# Altium schematic sheet ExpansionConnector.SchDoc: StepMotor Controller
size A4; Organization: NTUST EE-305; Address1: No.43, Sec. 4, Keelung Rd.; Address2: Da’an Dist.; Address3: Taipei 106; Address4: Taiwan (R.O.C.); DocumentNumber: 2; Revision: 1.0; SheetNumber: 2; SheetTotal: 8
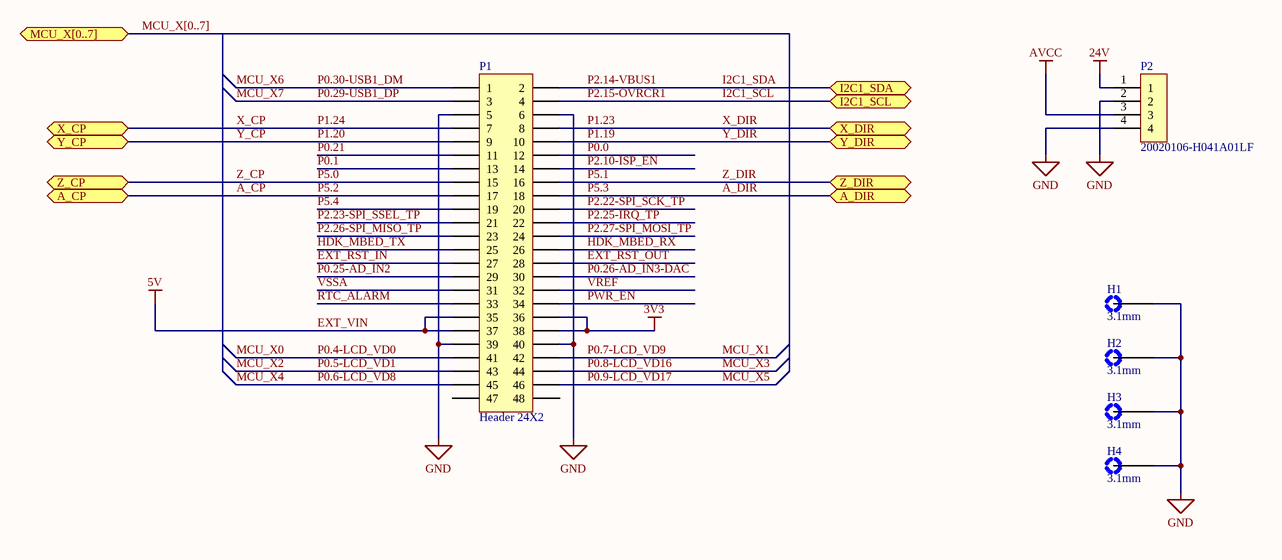
[diagram p0: ExpansionConnector.SchDoc]

## Parts
H1  3.1mm  [Holes]
H2  3.1mm  [Holes]
H3  3.1mm  [Holes]
H4  3.1mm  [Holes]
P1  Header 24X2  [HDR2X24]
P2  20020106-H041A01LF  [20020106-H041A01LF]

## Ports
A_CP, A_DIR, I2C1_SCL, I2C1_SDA, MCU_X[0..7], X_CP, X_DIR, Y_CP, Y_DIR, Z_CP, Z_DIR

## Nets
3V3: P1.36 P1.38
24V: P2.1
AVCC: P2.3
EXT_VIN: P1.35 P1.37  [also labelled 5V]
GND: H1.0 H2.0 H3.0 H4.0 P1.5 P1.6 P1.39 P1.40 P2.2 P2.4
A_CP: P1.17 ; port A_CP  [also labelled P5.2]
A_DIR: P1.18 ; port A_DIR  [also labelled P5.3]
EXT_RST_IN: P1.27
EXT_RST_OUT: P1.28
HDK_MBED_RX: P1.26
HDK_MBED_TX: P1.25
I2C1_SCL: P1.4 ; port I2C1_SCL  [also labelled P2.15-OVRCR1]
I2C1_SDA: P1.2 ; port I2C1_SDA  [also labelled P2.14-VBUS1]
MCU_X0: P1.41  [also labelled P0.4-LCD_VD0]
MCU_X1: P1.42  [also labelled P0.7-LCD_VD9]
MCU_X2: P1.43  [also labelled P0.5-LCD_VD1]
MCU_X3: P1.44  [also labelled P0.8-LCD_VD16]
MCU_X4: P1.45  [also labelled P0.6-LCD_VD8]
MCU_X5: P1.46  [also labelled P0.9-LCD_VD17]
MCU_X6: P1.1  [also labelled P0.30-USB1_DM]
MCU_X7: P1.3  [also labelled P0.29-USB1_DP]
P0.0: P1.12
P0.1: P1.13
P0.21: P1.11
P0.25-AD_IN2: P1.29
P0.26-AD_IN3-DAC: P1.30
P1.19: P1.10 ; port Y_DIR  [also labelled Y_DIR]
P1.20: P1.9 ; port Y_CP  [also labelled Y_CP]
P1.23: P1.8 ; port X_DIR  [also labelled X_DIR]
P1.24: P1.7 ; port X_CP  [also labelled X_CP]
P2.10-ISP_EN: P1.14
P2.22-SPI_SCK_TP: P1.20
P2.23-SPI_SSEL_TP: P1.21
P2.25-IRQ_TP: P1.22
P2.26-SPI_MISO_TP: P1.23
P2.27-SPI_MOSI_TP: P1.24
P5.0: P1.15 ; port Z_CP  [also labelled Z_CP]
P5.1: P1.16 ; port Z_DIR  [also labelled Z_DIR]
P5.4: P1.19
PWR_EN: P1.34
RTC_ALARM: P1.33
VREF: P1.32
VSSA: P1.31

Not connected (* = marked no-connect by the designer): P1 47 48

## Buses and harness runs
bus MCU_X[0..7] = port MCU_X[0..7]

## Notes on the sheet
- Title
- Name
- Size:
- Revision:
- A4
- Date:
- Time:
- Sheet
- of

## Library data of the parts
H1-H4 = Holes: Mounting Holes
P1 = Header 24X2: Header, 24-Pin, Dual row; LatestRevisionDate: 17-Jul-2002; LatestRevisionNote: Re-released for DXP Platform.; Publisher: Altium Limited
P2 = Amphenol FCI: TERM BLOCK HDR 4POS VERT 5.08MM